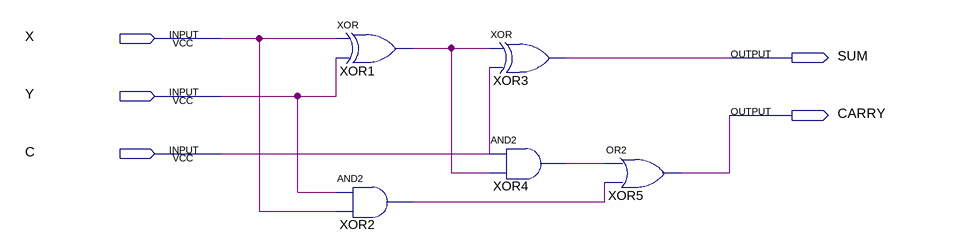
[diagram p0: schematic sheet]
// Quartus schematic FullAdder.bdf as structural Verilog: 5 symbols, 5 pins
module FullAdder (
  input  X,
  input  Y,
  input  C,
  output SUM,
  output CARRY
);

  wire XOR1_out, XOR2_out, XOR4_out;

  xor XOR1 (XOR1_out, X, Y);
  and XOR2 (XOR2_out, Y, X);
  xor XOR3 (SUM, XOR1_out, C);
  and XOR4 (XOR4_out, C, XOR1_out);
  or XOR5 (CARRY, XOR4_out, XOR2_out);
endmodule
